# EAGLE schematic atmega8-rfid-mold (EAGLE 5.11)
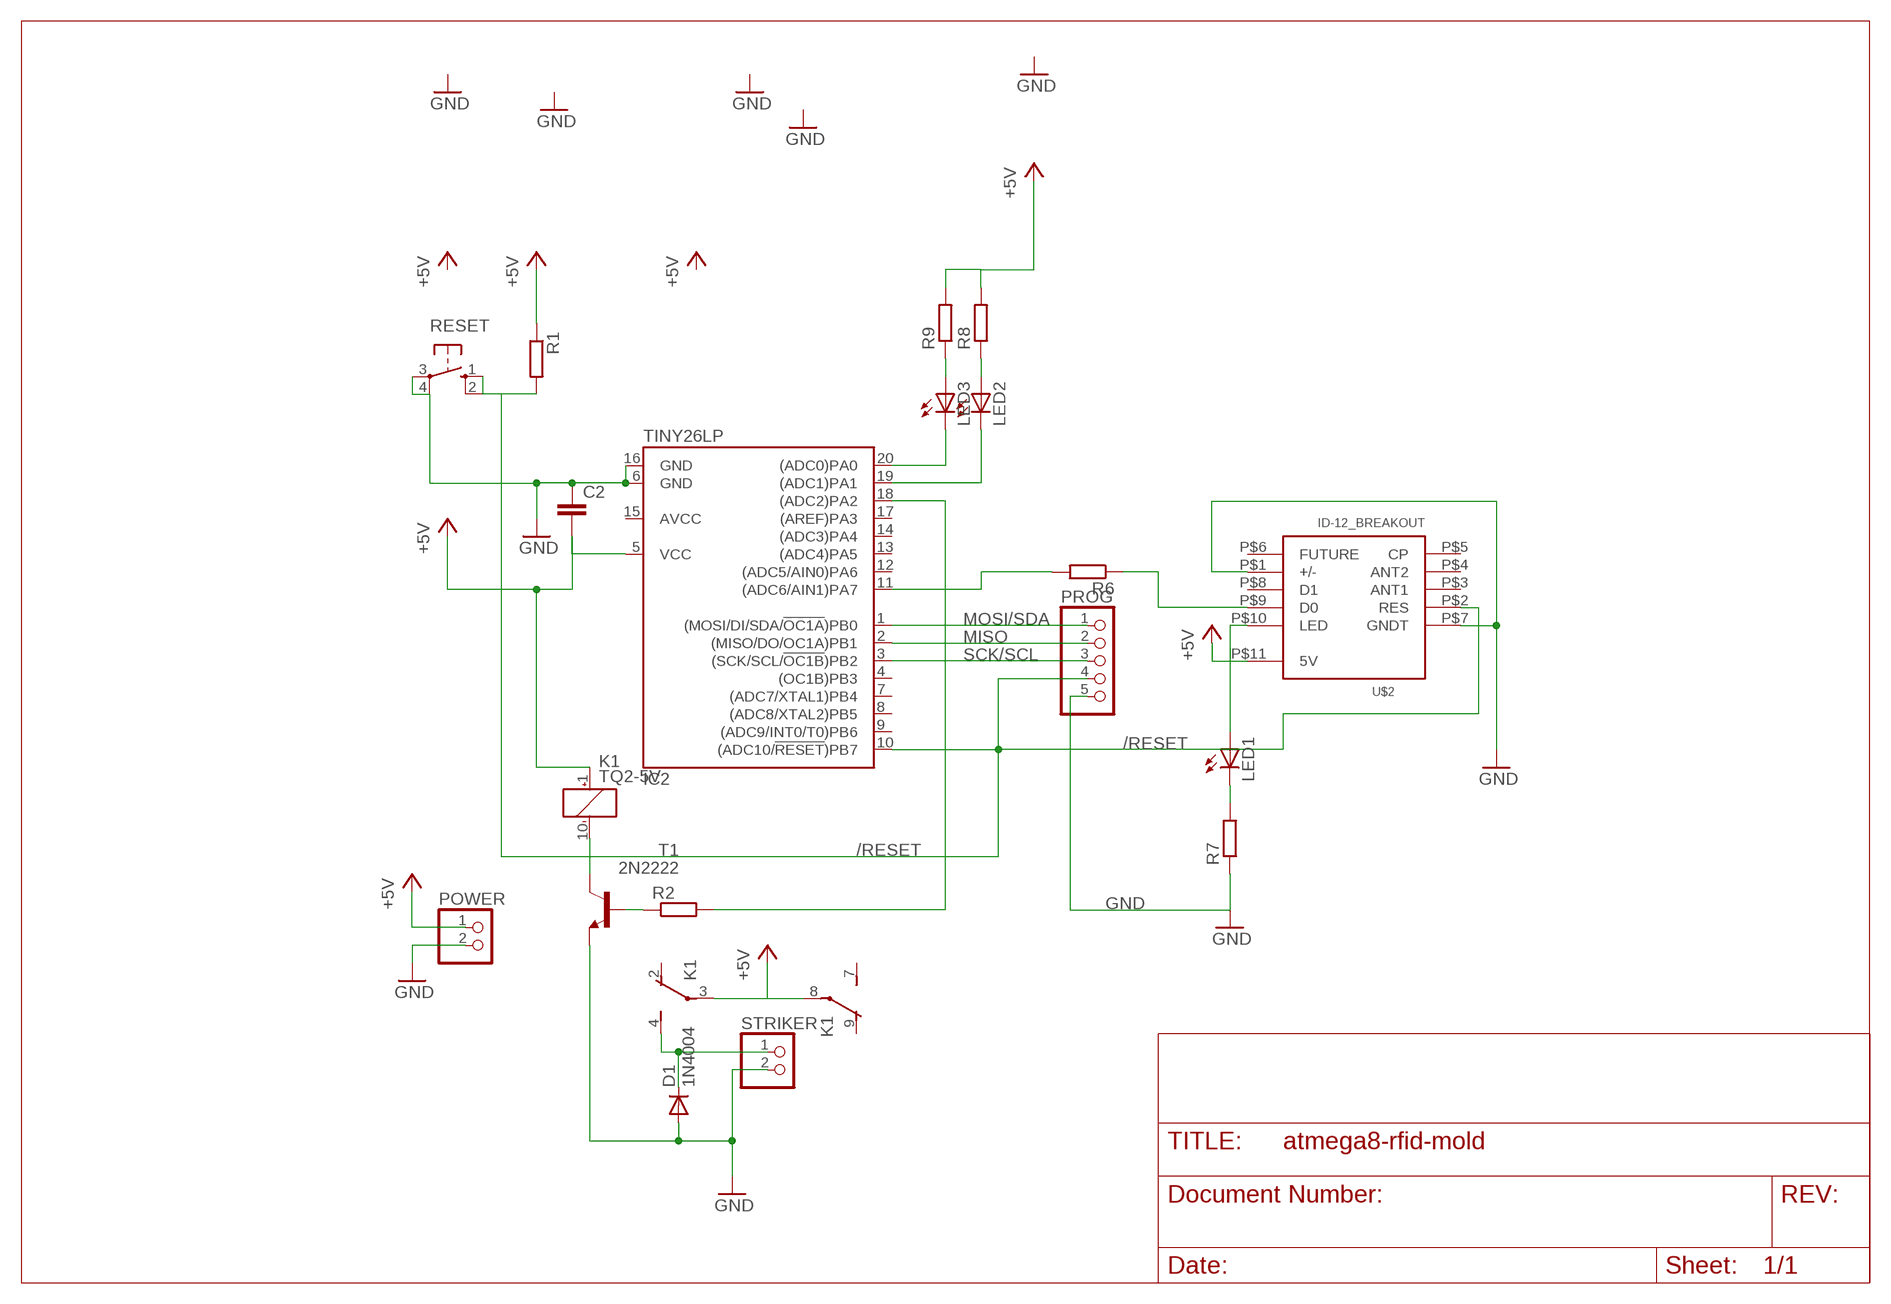
[diagram p0: schematic, sheet 1]

## Parts
C2  C-EU025-030X050  [C025-030X050]
D1  1N4004  [DO41-10]
IC2  TINY26LP  [DIL20]
K1  TQ2-5V  [TQ2]
LED1  LED3MM  [LED3MM]
LED2  LED3MM  [LED3MM]
LED3  LED3MM  [LED3MM]
POWER  PINHD-1X2  [1X02]
PROG  PINHD-1X5  [1X05]
R1  R-EU_0204/7  [0204/7]
R2  R-EU_0204/7  [0204/7]
R6  R-EU_0204/7  [0204/7]
R7  R-EU_0204/7  [0204/7]
R8  R-EU_0204/5  [0204/5]
R9  R-EU_0204/5  [0204/5]
RESET  10-XX  [B3F-10XX]
STRIKER  PINHD-1X2  [1X02]
T1  2N2222  [TO18]
U$2  ID-12_BREAKOUT  [ID-12_BREAKOUT]

## Nets
+5V: C2.2 IC2.5(VCC) K1.3(1:P) K1.8(2:P) POWER.1 R1.1 R8.2 R9.2 U$2.P$11(5V)
/RESET: IC2.10((ADC10/!RESET!)PB7) PROG.4 R1.2 RESET.1(S) RESET.2(S1) U$2.P$2(RES)
GND: C2.1 D1.A IC2.6(GND) IC2.16(GND) POWER.2 PROG.5 R7.1 RESET.3(P) RESET.4(P1) STRIKER.2 T1.1(E) U$2.P$1(+/-) U$2.P$7(GNDT)
MISO: IC2.2((MISO/DO/OC1A)PB1) PROG.2
MOSI/SDA: IC2.1((MOSI/DI/SDA/!OC1A!)PB0) PROG.1
N$1: IC2.18((ADC2)PA2) R2.2
N$3: LED3.A R9.1
N$4: LED2.A R8.1
N$5: R6.1 U$2.P$9(D0)
N$6: IC2.20((ADC0)PA0) LED3.K(C)
N$7: IC2.19((ADC1)PA1) LED2.K(C)
N$10: D1.C K1.4(1:S) STRIKER.1
N$21: LED1.A U$2.P$10(LED)
N$22: LED1.K(C) R7.2
N$23: K1.10(_:-) T1.3(C)
N$24: R2.1 T1.2(B)
RXD: IC2.11((ADC6/AIN1)PA7) R6.2
SCK/SCL: IC2.3((SCK/SCL/!OC1B!)PB2) PROG.3
Unconnected: IC2.4((OC1B)PB3) IC2.7((ADC7/XTAL1)PB4) IC2.8((ADC8/XTAL2)PB5) IC2.9((ADC9/INT0/T0)PB6) IC2.12((ADC5/AIN0)PA6) IC2.13((ADC4)PA5) IC2.14((ADC3)PA4) IC2.17((AREF)PA3) K1.1(_:+) K1.2(1:O) K1.7(2:S) K1.9(2:O) U$2.P$3(ANT1) U$2.P$4(ANT2) U$2.P$5(CP) U$2.P$6(FUTURE) U$2.P$8(D1)

## Power pins joined to a net without a drawn wire
AVCC: IC2.15(AVCC)

## Library data of the parts
C2 = rcl:C-EU: CAPACITOR, European symbol
D1 = diode:1N4004: DIODE general purpose rectifier, 1 A
IC2 = atmel:TINY26*: 8-bit AVR Microcontroller with 2K Bytes Flash Source: http://www.atmel.com .. doc1477.pdf; MPN: ATTINY26L-8PU; OC_FARNELL: 9171657; OC_NEWARK: 01M6920
K1 = relay:TQ2?*: LOW PROFILE 2 FORM C RELAY NAiS Source: http://www.mew-europe.com/.. en_ds_61020_0001.pdf Source: http://www.mew-europe.com/.. en_ds_61020_0004.pdf
LED1-LED3 = led:LED: LED OSRAM: - CHIPLED LG R971, LG N971, LY N971, LG Q971, LY Q971, LO R971, LY R971 LH N974, LH R974 LS Q976, LO Q976, LY Q976 LO Q996 - Hyper CHIPLED LW Q18S LB Q993, LB Q99A, LB R99A - SideLED LS A670, LO A670, LY A670, LG A670, LP A670 LB A673, LV A673, LT A673, LW A673 LH A674 LY A675 LS A676, LA A676, LO A676, LY A676, LW A676 LS A679, LY A679, LG A679 - Hyper Micro SIDELED® LS Y876, LA Y876, LO Y876, LY Y876 LT Y87S - SmartLED LW L88C, LW L88S LB L89C, LB L89S, LG L890 LS L89K, LO L89K, LY L89K LS L896, LA L896, LO L896, LY L896 - TOPLED LS T670, LO T670, LY T670, LG T670, LP T670 LSG T670, LSP T670, LSY T670, LOP T670, LYG T670 LG T671, LOG T671, LSG T671 LB T673, LV T673, LT T673, LW T673 LH T674 LS T676, LA T676, LO T676, LY T676, LB T676, LH T676, LSB T676, LW T676 LB T67C, LV T67C, LT T67C, LS T67K, LO T67K, LY T67K, LW E67C LS E67B, LA E67B, LO E67B, LY E67B, LB E67C, LV E67C, LT E67C LW T67C LS T679, LY T679, LG T679 LS T770, LO T770, LY T770, LG T770, LP T770 LB T773, LV T773, LT T773, LW T773 LH T774 LS E675, LA E675, LY E675, LS T675 LS T776, LA T776, LO T776, LY T776, LB T776 LHGB T686 LT T68C, LB T68C - Hyper Mini TOPLED® LB M676 - Mini TOPLED Santana® LG M470 LS M47K, LO M47K, LY M47K Source: http://www.osram.convergy.de LUXEON: - LUMILED® LXK2-PW12-R00, LXK2-PW12-S00, LXK2-PW14-U00, LXK2-PW14-V00 LXK2-PM12-R00, LXK2-PM12-S00, LXK2-PM14-U00 LXK2-PE12-Q00, LXK2-PE12-R00, LXK2-PE12-S00, LXK2-PE14-T00, LXK2-PE14-U00 LXK2-PB12-K00, LXK2-PB12-L00, LXK2-PB12-M00, LXK2-PB14-N00, LXK2-PB14-P00, LXK2-PB14-Q00 LXK2-PR12-L00, LXK2-PR12-M00, LXK2-PR14-Q00, LXK2-PR14-R00 LXK2-PD12-Q00, LXK2-PD12-R00, LXK2-PD12-S00 LXK2-PH12-R00, LXK2-PH12-S00 LXK2-PL12-P00, LXK2-PL12-Q00, LXK2-PL12-R00 Source: www.luxeon.com KINGBRIGHT: KA-3528ASYC Source: www.kingbright.com
POWER STRIKER = pinhead:PINHD-1X2: PIN HEADER
PROG = pinhead:PINHD-1X5: PIN HEADER
R1 R2 R6-R9 = rcl:R-EU_: RESISTOR, European symbol
RESET = switch-omron:10-XX: OMRON SWITCH
T1 = transistor:2N2222: NPN TRANSISTOR
U$2 = SparkFun:ID-12_BREAKOUT